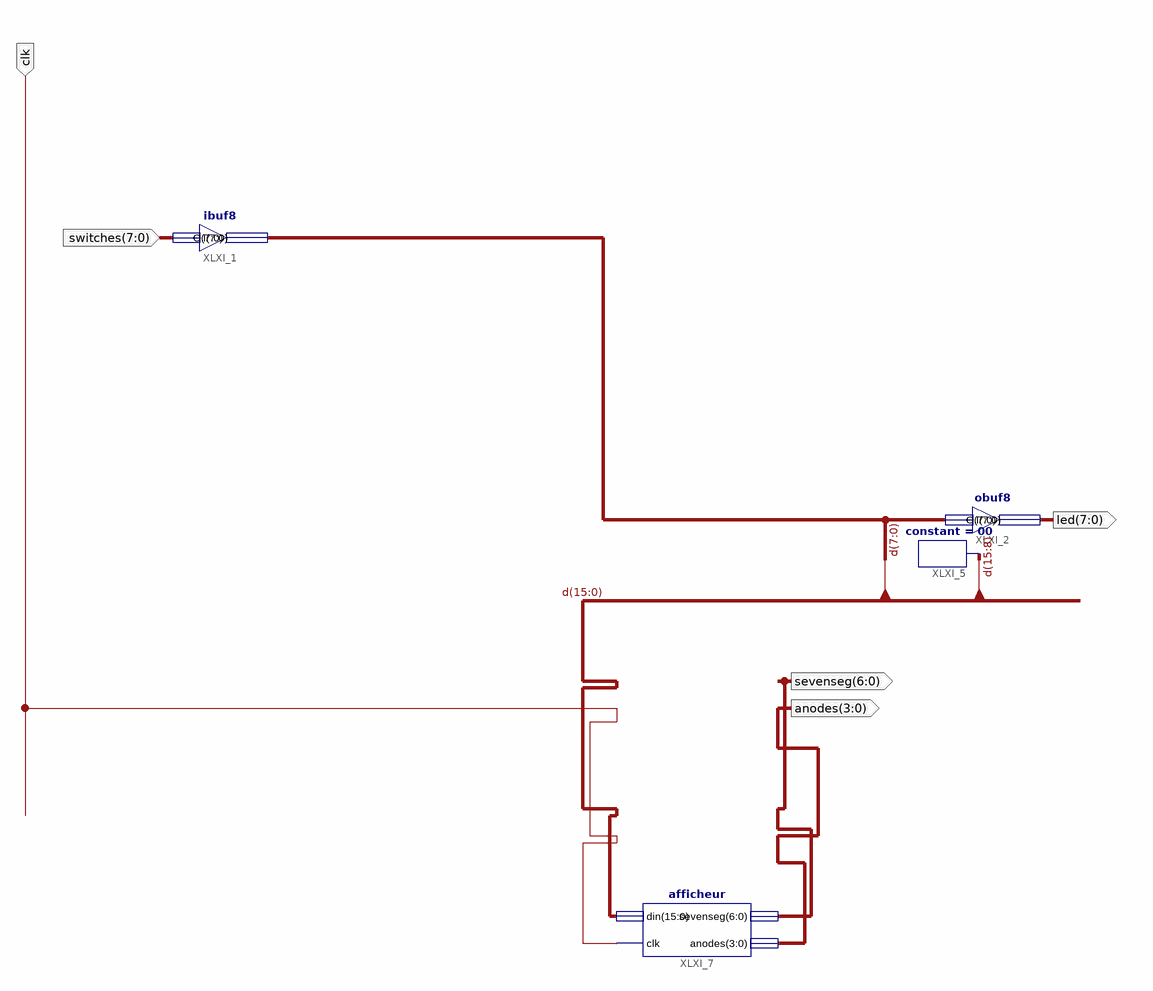
[diagram p0: schematic sheet 1]
// Xilinx ISE schematic toplevel.sch (spartan6) as structural Verilog: 4 symbols, 5 ports
module toplevel (
  input  [7:0] switches,
  input  clk,
  output [7:0] led,
  output [3:0] anodes,
  output [6:0] sevenseg
);

  wire [15:0] d;

  ibuf8 XLXI_1 (.I(switches), .O(d[7:0]));
  obuf8 XLXI_2 (.I(d[7:0]), .O(led));
  constant #(.CValue("00")) XLXI_5 (.O(d[15:8]));
  afficheur XLXI_7 (.din(d), .clk(clk), .sevenseg(sevenseg), .anodes(anodes));
endmodule
